# EAGLE design ohm loc controller rev2 (EAGLE 5.12)
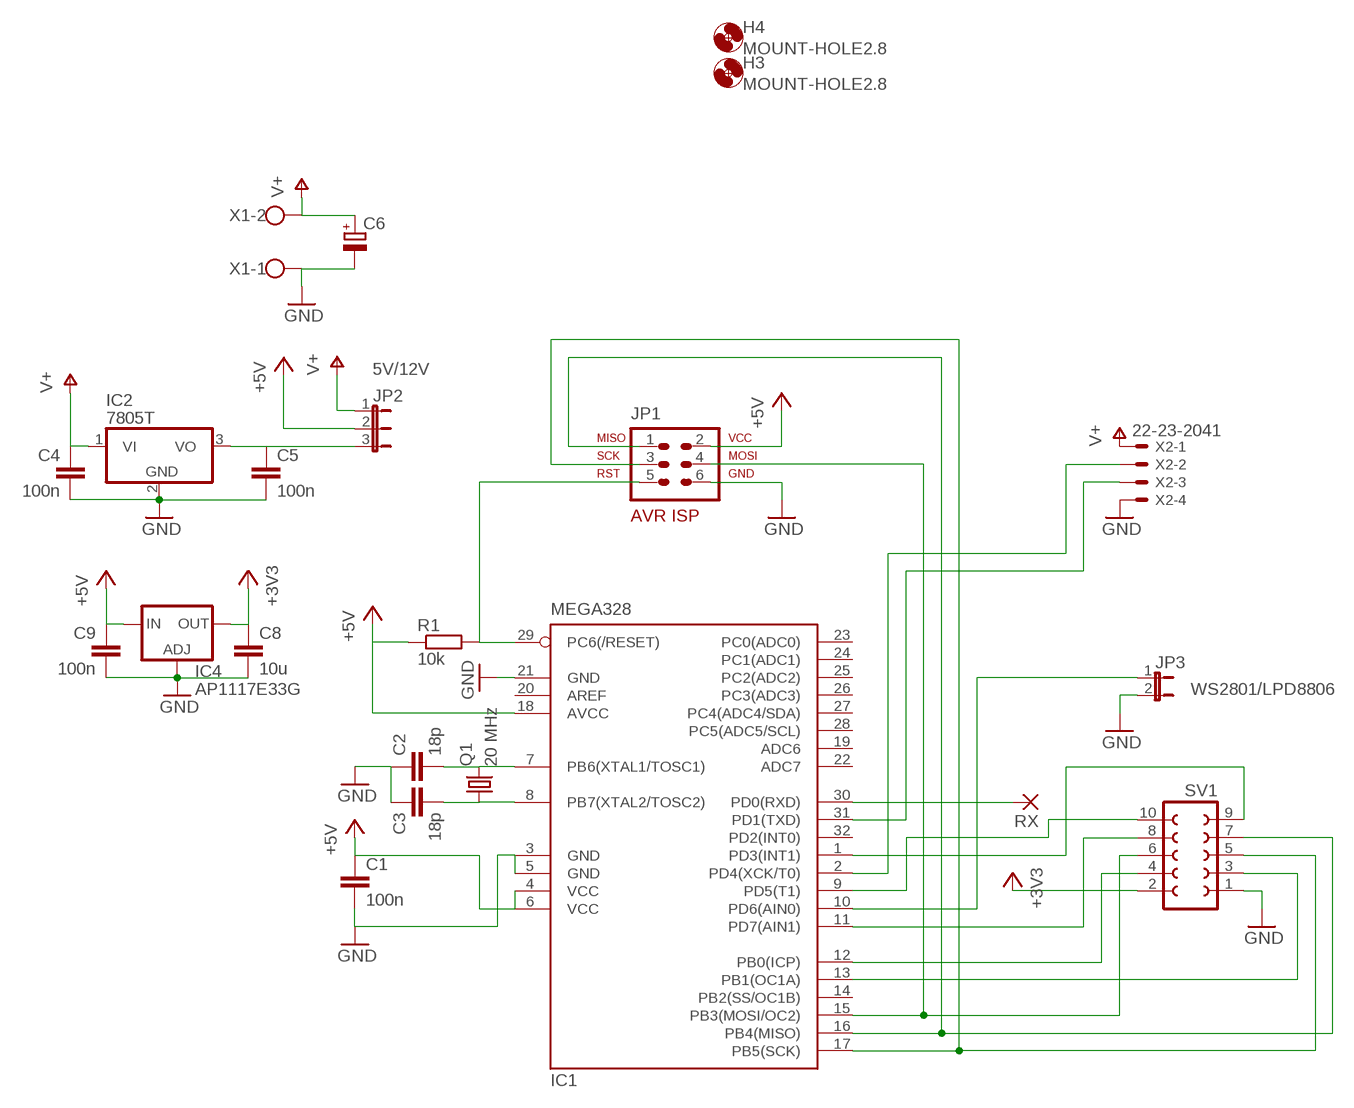
[diagram p0: schematic, sheet 1]

## Parts
C1  100n  C-EUC1206  [C1206]
C2  18p  C-EUC1206  [C1206]
C3  18p  C-EUC1206  [C1206]
C4  100n  C-EUC1206  [C1206]
C5  100n  C-EUC1206  [C1206]
C6  CPOL-EUE5-10.5  [E5-10,5]
C8  10u  C-EUC1206  [C1206]
C9  100n  C-EUC1206  [C1206]
H3  MOUNT-HOLE2.8  [2,8]
H4  MOUNT-HOLE2.8  [2,8]
IC1  MEGA328  MEGA8-AI  [TQFP32-08]
IC2  7805T  [TO220H]
IC4  AP1117E33G  LD117AS33TR  [SOT223]
JP1  ISP  AVR-ISP-6VERT  [AVR-ISP-6]
JP2  JP2E  [JP2]
JP3  JP1E  [JP1]
Q1  20 MHz  CSM-7X-DU  [CSM-7X-DU]
R1  10k  R-EU_R1206  [R1206]
RX  1,6/0,8  [1,6/0,8]
SV1  FE05-2  [FE05-2]
X1  W237-102  [W237-102]
X2  22-23-2041  [22-23-2041]

## Nets
+3V3: C8.1 IC4.4(OUT) SV1.2
+5V: C1.1 C9.1 IC1.4(VCC) IC1.6(VCC) IC1.18(AVCC) IC4.3(IN) JP1.2 JP2.2 R1.1
GND: C1.2 C2.1 C3.1 C4.2 C5.2 C6.- C8.2 C9.2 IC1.3(GND) IC1.5(GND) IC1.21(GND) IC2.2(GND) IC4.1(ADJ) JP1.6 JP3.2 SV1.1 X1.1 X2.4
N$1: IC1.29(PC6(/RESET)) JP1.5 R1.2
N$2: IC1.12(PB0(ICP)) SV1.4
N$3: IC1.13(PB1(OC1A)) SV1.3
N$4: C2.2 IC1.7(PB6(XTAL1/TOSC1)) Q1.2
N$5: C3.2 IC1.8(PB7(XTAL2/TOSC2)) Q1.1
N$6: C5.1 IC2.3(VO) JP2.3
N$7: IC1.15(PB3(MOSI/OC2)) JP1.4 SV1.6
N$8: IC1.16(PB4(MISO)) JP1.1 SV1.7
N$9: IC1.17(PB5(SCK)) JP1.3 SV1.5
N$10: IC1.1(PD3(INT1)) SV1.9
N$11: IC1.11(PD7(AIN1)) SV1.8
N$12: IC1.10(PD6(AIN0)) JP3.1
N$13: IC1.30(PD0(RXD)) RX.1(P)
N$14: IC1.9(PD5(T1)) SV1.10
N$16: IC1.31(PD1(TXD)) X2.3
N$17: IC1.2(PD4(XCK/T0)) X2.2
V+: C4.1 C6.+ IC2.1(VI) JP2.1 X1.2 X2.1
Unconnected: IC1.14(PB2(SS/OC1B)) IC1.19(ADC6) IC1.20(AREF) IC1.22(ADC7) IC1.23(PC0(ADC0)) IC1.24(PC1(ADC1)) IC1.25(PC2(ADC2)) IC1.26(PC3(ADC3)) IC1.27(PC4(ADC4/SDA)) IC1.28(PC5(ADC5/SCL)) IC1.32(PD2(INT0))

## Notes on the sheet
- 5V/12V
- WS2801/LPD8806

## Library data of the parts
C1-C5 C8 C9 = rcl:C-EU: CAPACITOR, European symbol
C6 = rcl:CPOL-EU: POLARIZED CAPACITOR, European symbol
H3 H4 = holes:MOUNT-HOLE: MOUNTING HOLE with drill center marker
IC1 = atmel:MEGA8: MICROCONTROLLER 8 Kbytes FLASH, 1 kbytes SRAM, 512 bytes EEPROM, USART, 6-channel 10 bit ADC, 2-channel 8 bit ADC Pin compatible with Atmega48, ATMega88, ATMega168 Source: avr.lbr; MPN: ATMEGA8-16AU; OC_FARNELL: 9171371; OC_NEWARK: 73M8863
IC2 = linear:78*: Positive VOLTAGE REGULATOR Source: http://cache.national.com/ds/LM/LM78L05.pdf http://www.fairchildsemi.com/ds/LM/LM7805.pdf
IC4 = v-reg:LD117A?*: Low drop fixed and adjustable positive voltage regulators 1 A Source: http://www.st.com/stonline/products/literature/ds/7194/ld1117axx.pdf
JP1 = avr-7:AVR-ISP-6: AVR ISP-6 Serial Programming Header
JP2 = jumper:JP2E: JUMPER
JP3 = jumper:JP1E: JUMPER
Q1 = crystal:CSM-7X-DU: SMD CRYSTAL Source: www.ecsxtal.com .. Crystal 3.6864MHz CSM_7X_DU.PDF; OC_FARNELL: unknown; OC_NEWARK: unknown
R1 = rcl:R-EU_: RESISTOR, European symbol
RX = wirepad:1,6/0,8: THROUGH-HOLE PAD
SV1 = con-lsta:FE05-2: FEMALE HEADER; OC_FARNELL: unknown; OC_NEWARK: unknown
X1 = con-wago-500:W237-102: WAGO SCREW CLAMP; MPN: 237-102; OC_FARNELL: unknown; OC_NEWARK: 70K9898
X2 = con-molex:22-23-2041: .100" (2.54mm) Center Header - 4 Pin; MF: MOLEX; MPN: 22-23-2041; OC_FARNELL: 1462920; OC_NEWARK: 38C0355

## Board
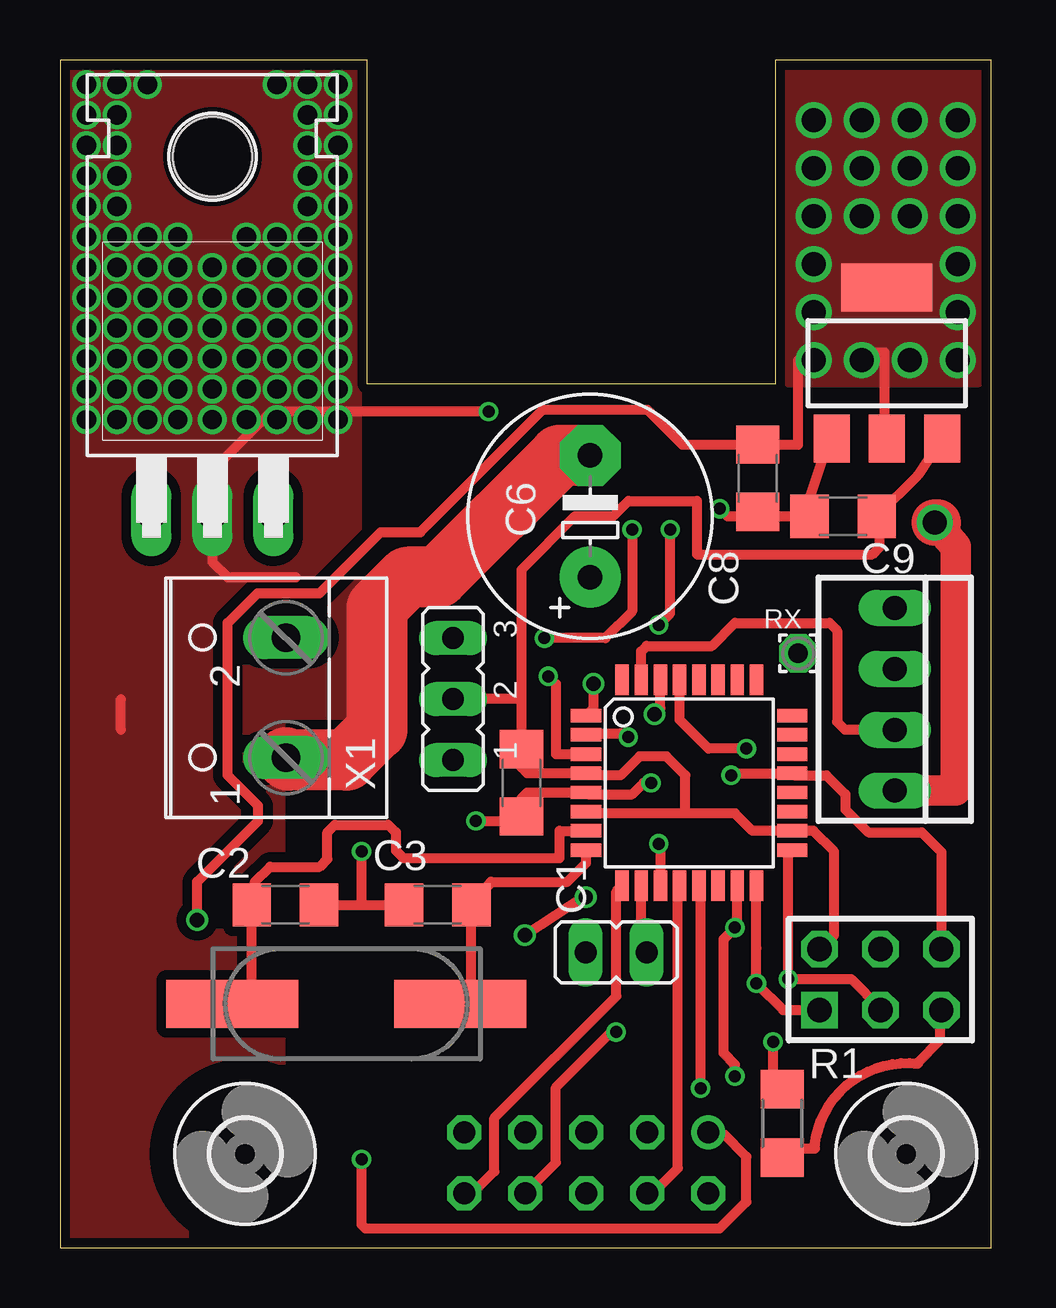
[diagram p1: board, top side]
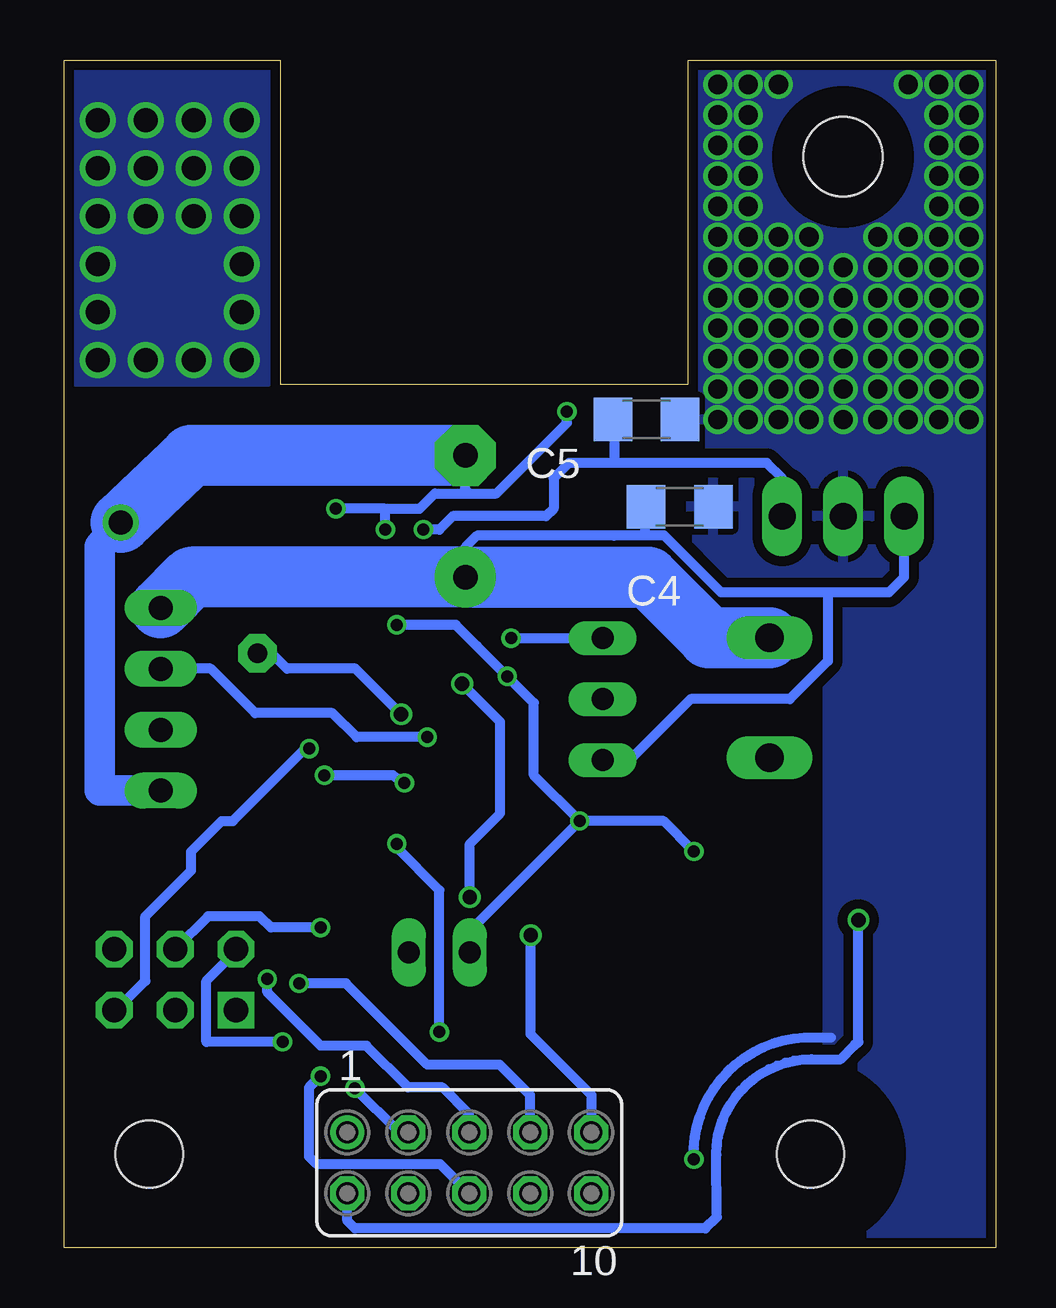
[diagram p2: board, bottom side, seen from below]

Size 38.81 x 49.5 mm. Coordinates in mm from the lower left corner, seen from the top.
Outline: 0,0 38.81,0 38.81,49.5 29.81,49.5 29.81,36 12.81,36 12.81,49.5 0,49.5 0,0
Copper layers (1*16): Top 0.035mm / dielectric 1.5mm / Bottom 0.035mm
Design rules "ITEADstudio_DRC *": minimum track width 6mil, minimum drill 12mil, track to track 9mil, track to pad 9mil, pad to pad 9mil, via to via 9mil, smd to smd 0mil, copper to edge 10mil, drill to drill 10mil, minimum pad ring 10mil, minimum via ring 6mil, stop-mask expansion 2mil, vias tented up to drill 100mil, thermal gap 10mil

### Footprints (pad centres in the part's own frame; a part is rotated, then mirrored left to right if it is on the bottom)
C1206 = smd 1.6 x 1.8: 1 -1.4,0; 2 1.4,0
E5-10,5 = drill 1.016 pad 2.54 round: + -2.54,0 | drill 1.016 pad 2.54 octagon: - 2.54,0
2,8 = hole 2.8: 0,0
TQFP32-08 = smd 1.27 x 0.559: 1 -4.293,2.8; 2 -4.293,2; 3 -4.293,1.2; 4 -4.293,0.4; 5 -4.293,-0.4; 6 -4.293,-1.2; 7 -4.293,-2; 8 -4.293,-2.8; 17 4.293,-2.8; 18 4.293,-2; 19 4.293,-1.2; 20 4.293,-0.4; 21 4.293,0.4; 22 4.293,1.2; 23 4.293,2; 24 4.293,2.8 | smd 0.559 x 1.27: 9 -2.8,-4.293; 10 -2,-4.293; 11 -1.2,-4.293; 12 -0.4,-4.293; 13 0.4,-4.293; 14 1.2,-4.293; 15 2,-4.293; 16 2.8,-4.293; 25 2.8,4.293; 26 2,4.293; 27 1.2,4.293; 28 0.4,4.293; 29 -0.4,4.293; 30 -1.2,4.293; 31 -2,4.293; 32 -2.8,4.293
TO220H = drill 1.118 long: 1 -2.54,-10.16; 2 0,-10.16; 3 2.54,-10.16 | hole 3.302: 0,4.826
SOT223 = smd 1.5 x 2: 1 -2.3,-3.15; 2 0,-3.15; 3 2.3,-3.15 | smd 3.8 x 2: 4 0,3.15
AVR-ISP-6 = drill 1.016 square: 1 -2.54,-1.27 | drill 1.016 octagon: 2 -2.54,1.27; 3 0,-1.27; 4 0,1.27; 5 2.54,-1.27; 6 2.54,1.27
JP2 = drill 0.914 long: 1 -2.54,0; 2 0,0; 3 2.54,0
JP1 = drill 0.914 long: 1 0,-1.27; 2 0,1.27
CSM-7X-DU = smd 5.5 x 2: 1 -4.75,0; 2 4.75,0
R1206 = smd 1.6 x 1.803: 1 -1.422,0; 2 1.422,0
1,6/0,8 = drill 0.813 pad 1.6 octagon: 1 0,0
FE05-2 = drill 0.914 round: 1 -5.08,1.27 | drill 0.914 octagon: 2 -5.08,-1.27; 3 -2.54,1.27; 4 -2.54,-1.27; 5 0,1.27; 6 0,-1.27; 7 2.54,1.27; 8 2.54,-1.27; 9 5.08,1.27; 10 5.08,-1.27
W237-102 = drill 1.194 long: 1 -2.5,-1.27; 2 2.5,-1.27
22-23-2041 = drill 1 long: 1 -3.81,0; 2 -1.27,0; 3 1.27,0; 4 3.81,0

### Placement (x,y rotation side)
C1  19.23,19.37 270 top
C2  9.39,14.29 180 top
C3  15.74,14.29 0 top
C4  13.16,30.88 0 bottom
C5  14.55,34.52 0 bottom
C6  22.09,30.48 90 top
C8  29.07,32.07 270 top
C9  32.63,30.48 180 top
H3  7.71,3.9 0 top
H4  35.26,3.9 0 top
IC1  26.22,19.37 0 top
IC2  6.35,40.64 0 top
IC4  34.45,36.86 0 top
JP1  34.18,11.17 0 top
JP2  16.38,22.86 90 top
JP3  23.17,12.3 90 top
Q1  11.93,10.16 180 top
R1  30.09,5.18 270 top
RX  30.76,24.77 0 top
SV1  21.93,3.53 0 bottom
X1  8.15,22.92 90 top
X2  34.78,22.85 270 top

### Tracks (layer width: path | path; a pad name or v marks a point on that pad's centre or on a via)
+3V3  (via drill 0.6, 1)
  Top 0.406: 34.52,33.66 34.36,33.66 34.36,37.31 33.73,37.31 v33.41,36.99 | v33.41,36.99 v33.41,37 | v33.41,36.99 33.25,36.83 | v31.41,37 31.41,36.98 30.75,36.98 30.75,33.47 C8.1 25.93,33.47 24.47,34.92 20.12,34.92 15.01,29.82 13.36,29.82 10.82,27.28 8.23,27.28 6.99,26.04 6.99,19.68 8.26,18.41 8.26,17.78 5.71,15.24 v5.71,13.65
  Bottom 0.406: SV1.2 27.01,2.76 27.01,1.11 26.69,0.79 12.09,0.79 11.61,1.27 11.63,3.88 arc90 7.66,7.85 6.46,7.85 5.89,8.43 | 5.89,8.43 5.74,8.57 | v5.71,13.65 5.71,8.57 5.89,8.43
  other vias: 31.41,39 31.41,41 31.41,43 31.41,45 31.41,47 33.41,47 33.41,45 33.41,43 35.41,37 35.41,43 35.41,45 35.41,47 37.41,47 37.41,45 37.41,43 37.41,41 37.41,39 37.41,37
  pour Top (isolate 0.406, no thermals): 38.31,36 38.31,49.5 30.31,49.5 30.31,36
  pour Bottom (isolate 0.406, no thermals): 38.31,36 38.31,49.5 30.31,49.5 30.31,36
+5V  (via drill 0.5)
  Top 0.406: IC4.3 35.75,32.2 C9.1 34.16,30.36 34.16,29.21 33.84,28.89 26.54,28.89 26.54,31.11 23.68,31.11 23.04,30.48 21.45,30.48 19.23,28.26 19.23,22.86 | 19.23,22.86 C1.1 19.23,20 19.47,19.77 IC1.4 21.93,19.68 23.36,19.68 24.15,20.48 25.27,20.48 26.06,19.68 26.06,18.1 | JP1.2 32.25,13.02 32.25,16.51 31.39,17.37 IC1.18 28.85,17.37 28.12,18.1 26.06,18.1 | IC1.6 22,18.1 26.06,18.1 | 19.23,22.86 JP2.2 | v29.71,8.57 29.71,6.98 R1.1
  Bottom 0.406: JP1.2 32.03,11.96 32.88,11.11 32.88,8.57 v29.71,8.57
GND  (via drill 0.5, 0.8, 1)
  Top 0.406: IC4.1 31.98,33.54 30.98,30.48 C9.2 29.2,30.48 | 29.2,30.48 C8.2 | v27.49,30.8 27.8,30.48 29.2,30.48 | C2.1 12.56,14.29 | 12.56,14.29 C3.1 | v17.33,17.78 19.05,17.78 C1.2 19.23,18.73 19.47,18.97 IC1.5 22,18.89 23.84,18.89 24.31,19.37 v24.63,19.37 | IC1.3 20.66,20.57 20.66,23.5 v20.34,23.81 | 12.56,14.29 v12.56,16.51 | v27.96,19.68 28.05,19.77 IC1.21 30.59,19.68 31.93,19.68 32.73,18.89 32.73,18.26 33.68,17.3 35.9,17.3 36.72,16.48 JP1.6 | SV1.1 27.01,4.74 27.65,4.74 28.6,3.79 28.6,1.91 27.49,0.79 12.72,0.79 12.56,0.95 v12.56,3.67 | X2.4 | v25.42,29.92 25.42,26.43 v24.95,25.96 | v36.44,30.23 v36.45,30.23 | 9.84,27.94 6.99,27.94 6.35,28.57 IC2.2 6.35,32.38 8.81,34.85 v17.86,34.85 | 2.54,21.59 2.54,22.86
  Top 1.27: v36.44,30.23 37.33,29.21 37.33,19.05 X2.4
  Top 1.93: v36.45,30.23 36.58,30.23
  Top 2.54: C6.- 20.82,33.02 15.74,27.94 14.47,27.94 13.2,26.67 13.2,21.59 11.93,20.32 9.52,20.32 X1.1
  Bottom 0.406: 25.42,30.8 24,30.8 23.36,31.43 21.93,31.43 | 25.42,30.8 v27.49,30.8 | v25.42,29.92 25.42,30.8 | 19.23,22.7 v20.34,23.81 21.61,25.08 22.49,25.96 v24.95,25.96 | 19.23,22.7 | 19.23,22.7 19.23,19.68 v17.33,17.78 | v17.33,17.78 13.84,17.78 v12.56,16.51 | C6.- 22.09,31.59 21.93,31.43 | v27.96,19.68 25.11,19.68 v24.63,19.37 | v12.56,3.67 arc90 7.96,8.76 | 7.96,8.76 | 7.96,8.76 | 7.96,8.76 6.85,8.76 | JP3.2 21.9,13.21 v17.33,17.78 | v17.86,34.85 17.86,34.37 20.8,31.43 21.93,31.43
  Bottom 1.27: v36.44,30.23 37.33,29.21 37.33,19.05 X2.4
  Bottom 2.54: C6.- 33.52,33.02 v36.44,30.23
  other vias: 1.1,48.48 1.1,47.21 1.1,45.94 1.1,44.67 1.1,43.4 1.1,42.13 1.1,40.86 1.1,39.59 1.1,38.32 2.37,48.48 2.37,47.21 2.37,45.94 2.37,44.67 2.37,43.4 2.37,42.13 2.37,40.86 2.37,39.59 2.37,38.32 11.58,48.48 11.58,47.21 11.58,45.94 11.58,44.67 11.58,43.4 11.58,42.13 11.58,40.86 11.58,39.59 10.31,48.48 10.31,47.21 10.31,45.94 10.31,44.67 10.31,43.4 10.31,42.13 10.31,40.86 10.31,39.59 3.64,48.48 9.04,48.48 3.64,42.13 4.91,42.13 9.04,42.13 7.77,42.13 3.64,40.86 4.91,40.86 7.77,40.86 9.04,40.86 4.91,39.59 3.64,39.59 9.04,39.59 7.77,39.59 3.64,38.32 4.91,38.32 7.77,38.32 9.04,38.32 10.31,38.32 11.58,38.32 6.34,40.86 6.34,39.59 6.34,38.32 1.1,37.05 1.1,35.78 2.37,37.05 2.37,35.78 11.58,37.05 10.31,37.05 4.91,37.05 3.64,37.05 9.04,37.05 7.77,37.05 3.64,35.78 4.91,35.78 7.77,35.78 9.04,35.78 10.31,35.78 11.58,35.78 6.34,37.05 6.34,35.78 1.1,34.51 2.37,34.51 3.64,34.51 4.91,34.51 7.77,34.51 9.04,34.51 10.31,34.51 11.58,34.51 6.34,34.51
  pour Top (isolate 0.406): 12.38,49.53 0,49.53 0,22.23 12.38,22.23
  pour Bottom (isolate 0.406): 0,49.53 12.7,49.53 12.7,24.45 0,24.45
  pour Top (isolate 0.406): 0,22.23 0,0 9.21,0 9.21,22.23
  pour Bottom (isolate 0.406): 0,29.53 0,0 6.99,-0.32 6.99,29.53
  pour Top (isolate 0.406, no thermals): 2.54,33.34 10.16,33.34 10.16,28.26 2.54,28.26
N$1  (via drill 0.5)
  Top 0.406: v28.6,20.8 27.01,20.8 25.82,21.99 IC1.29 | R1.2 30.09,4.03 arc-90 30.19,4.13 31.46,4.13 31.46,4.29 arc-90 35.75,7.67 35.73,7.71 36.69,8.66 36.7,9.87 JP1.5
  Bottom 0.406: JP1.5 36.64,9.9 35.42,11.11 35.42,13.81 33.52,15.72 33.52,16.51 32.25,17.78 31.77,17.78 28.76,20.8 v28.6,20.8 | v28.6,20.8
N$2
  Top 0.406: SV1.4 24.69,2.26 25.74,3.31 25.74,15 IC1.12
N$3  (via drill 0.5)
  Top 0.406: v26.69,6.64 26.69,15 IC1.13
  Bottom 0.406: SV1.3 24.85,4.8 v26.69,6.64 | v26.69,6.64
N$4
  Top 0.406: Q1.2 7.99,10.16 C2.2 8.12,14.42 8.12,15.24 8.76,15.88 10.82,15.88 11.14,16.19 11.14,17.3 11.45,17.62 13.68,17.62 13.99,17.3 13.99,16.55 14.31,16.23 20.82,16.23 20.82,17.37 IC1.7
N$5
  Top 0.406: Q1.1 17.14,10.16 C3.2 17.96,15.24 21.14,15.24 21.93,16.03 IC1.8
N$6  (via drill 0.5)
  Top 0.406: v20.18,25.4 22.73,25.4 23.84,26.51 v23.84,29.92
  Bottom 0.406: v20.18,25.4 JP2.3 | v23.84,29.92 23.18,29.92 22.62,30.48 18.73,30.48 18.41,30.8 18.41,32.07 17.78,32.7 15.88,32.7 | 16.17,34.29 C5.1 15.88,34.45 15.88,32.7 | 15.88,32.7 9.53,32.7 8.89,32.07 IC2.3
N$7  (via drill 0.5)
  Top 0.406: IC1.15 28.22,13.43 v28.12,13.34 27.65,12.86 27.65,8.1 28.12,7.62 v28.12,7.14
  Bottom 0.406: JP1.4 32.81,13.81 30.66,13.81 30.19,13.34 v28.12,13.34 | v28.12,7.14 28.6,6.67 28.6,3.79 28.28,3.47 23.14,3.47 SV1.6
N$8  (via drill 0.5)
  Top 0.406: JP1.1 30.13,9.9 v29.02,11.01 29.02,12.48 IC1.16
  Bottom 0.406: v29.02,11.01 27.07,11.01 23.68,7.62 20.66,7.62 19.39,6.35 19.39,5.3 SV1.7
N$9  (via drill 0.5)
  Top 0.406: JP1.3 34.18,9.98 32.96,11.19 v30.34,11.19 30.34,16.4 IC1.17
  Bottom 0.406: SV1.5 21.93,5.55 23.04,6.67 24.47,6.67 26.22,8.41 28.12,8.41 30.34,10.64 v30.34,11.19
N$10  (via drill 0.6)
  Top 0.406: IC1.1 22.23,22.47 v22.23,23.5 | v21.91,14.61 21.91,14.68 v19.37,13.02
  Bottom 0.406: v22.23,23.5 20.64,21.91 20.64,18.1 21.91,16.83 v21.91,14.61 | v19.37,13.02 19.37,8.89 16.83,6.35 16.83,4.82 SV1.9
N$11  (via drill 0.5)
  Top 0.406: IC1.11 25.02,16.76 v24.95,16.83 | SV1.8 20.66,3.53 20.66,6.67 22.98,8.98 v23.17,8.98
  Bottom 0.406: v24.95,16.83 24.95,16.67 23.17,14.89 v23.17,8.98
N$12
  Top 0.406: IC1.10 24.22,12.53 JP3.1
N$13  (via drill 0.6)
  Top 0.406: v24.77,22.23 25.02,22.48 IC1.30
  Bottom 0.406: v24.77,22.23 26.67,24.13 29.53,24.13 30.16,24.77 RX.1
N$14
  Top 0.406: IC1.9 23.18,14.84 23.18,10.48 18.1,5.4 18.1,3.17 17.18,2.26 SV1.10
N$16
  Top 0.406: IC1.31 24.22,24.85 24.45,25.08 27.17,25.08 28.12,26.04 32.07,26.04 32.38,25.72 32.38,21.91 32.7,21.59 X2.3
N$17  (via drill 0.5)
  Top 0.406: v23.68,21.27 23.52,21.27 23.36,21.43 21.99,21.43 IC1.2
  Bottom 0.406: v23.68,21.27 26.62,21.27 27.63,22.28 30.85,22.28 32.7,24.13 X2.2
V+
  Bottom 0.406: 14.47,27.94 14.47,28.71 | C6.+ 22.09,29.19 21.61,29.67 15.89,29.67 | JP2.1 15.24,20.32 12.7,22.86 8.57,22.86 6.99,24.45 6.99,27.3 | 6.99,27.3 11.43,27.3 13.81,29.69 14.61,29.69 | 15.89,29.67 15.88,29.69 14.61,29.69 | 15.89,29.67 15.91,29.68 | C4.1 14.61,30.88 14.61,29.69 | 6.99,27.3 4.45,27.3 3.81,27.94 IC2.1
  Bottom 2.54: X1.2 11.95,25.42 14.47,27.94 C6.+ 33.51,27.94 X2.1

### Text on the board
tValues: + | + | 12V | - | 5V | - | S:PIXEL | O:STRIP
tDocu: For: OHM 2013 | Designed by: Bob van Loosen | Art-Net to LED strip interface